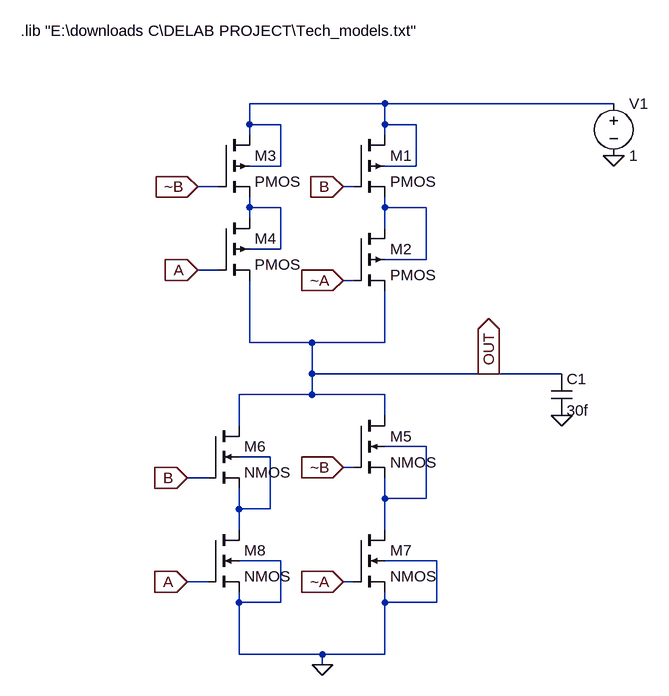
[diagram p0: schematic gate_xorr.asc]
gate_xorr.asc, the LTspice schematic file:
Version 4
SHEET 1 880 872
WIRE 272 -48 64 -48
WIRE 624 -48 272 -48
WIRE 64 -16 64 -48
WIRE 112 -16 64 -16
WIRE 272 -16 272 -48
WIRE 320 -16 272 -16
WIRE 64 0 64 -16
WIRE 272 0 272 -16
WIRE 112 48 112 -16
WIRE 112 48 64 48
WIRE 320 48 320 -16
WIRE 320 48 272 48
WIRE 16 80 -16 80
WIRE 224 80 208 80
WIRE 64 112 64 96
WIRE 112 112 64 112
WIRE 272 112 272 96
WIRE 336 112 272 112
WIRE 64 128 64 112
WIRE 272 144 272 112
WIRE 112 176 112 112
WIRE 112 176 64 176
WIRE 336 192 336 112
WIRE 336 192 272 192
WIRE 16 208 -16 208
WIRE 224 224 208 224
WIRE 64 320 64 224
WIRE 160 320 64 320
WIRE 272 320 272 240
WIRE 272 320 160 320
WIRE 160 368 160 320
WIRE 432 368 160 368
WIRE 544 368 432 368
WIRE 160 400 160 368
WIRE 160 400 48 400
WIRE 272 400 160 400
WIRE 272 432 272 400
WIRE 48 448 48 400
WIRE 336 480 272 480
WIRE 96 496 48 496
WIRE 224 512 208 512
WIRE 0 528 -32 528
WIRE 272 560 272 528
WIRE 336 560 336 480
WIRE 336 560 272 560
WIRE 48 576 48 544
WIRE 96 576 96 496
WIRE 96 576 48 576
WIRE 48 608 48 576
WIRE 272 608 272 560
WIRE 112 656 48 656
WIRE 352 656 272 656
WIRE 0 688 -32 688
WIRE 224 688 208 688
WIRE 48 720 48 704
WIRE 112 720 112 656
WIRE 112 720 48 720
WIRE 272 720 272 704
WIRE 352 720 352 656
WIRE 352 720 272 720
WIRE 48 800 48 720
WIRE 176 800 48 800
WIRE 272 800 272 720
WIRE 272 800 176 800
WIRE 176 816 176 800
FLAG 624 32 0
FLAG 544 432 0
FLAG 432 368 OUT
IOPIN 432 368 Out
FLAG -16 208 A
IOPIN -16 208 In
FLAG -32 688 A
IOPIN -32 688 In
FLAG 208 80 B
IOPIN 208 80 In
FLAG -32 528 B
IOPIN -32 528 In
FLAG -16 80 ~B
IOPIN -16 80 In
FLAG 208 512 ~B
IOPIN 208 512 In
FLAG 208 224 ~A
IOPIN 208 224 In
FLAG 208 688 ~A
IOPIN 208 688 In
FLAG 176 816 0
SYMBOL pmos4 224 0 R0
SYMATTR InstName M1
SYMATTR Value2 l=32n w=128n
SYMBOL pmos4 224 144 R0
SYMATTR InstName M2
SYMATTR Value2 l=32n w=128n
SYMBOL pmos4 16 0 R0
SYMATTR InstName M3
SYMATTR Value2 l=32n w=128n
SYMBOL pmos4 16 128 R0
SYMATTR InstName M4
SYMATTR Value2 l=32n w=128n
SYMBOL nmos4 224 432 R0
SYMATTR InstName M5
SYMATTR Value2 l=32n w=64n
SYMBOL nmos4 0 448 R0
SYMATTR InstName M6
SYMATTR Value2 l=32n w=64n
SYMBOL nmos4 224 608 R0
SYMATTR InstName M7
SYMATTR Value2 l=32n w=64n
SYMBOL nmos4 0 608 R0
SYMATTR InstName M8
SYMATTR Value2 l=32n w=64n
SYMBOL voltage 624 -64 R0
WINDOW 123 0 0 Left 0
WINDOW 39 0 0 Left 0
SYMATTR InstName V1
SYMATTR Value 1
SYMBOL cap 528 368 R0
SYMATTR InstName C1
SYMATTR Value 30f
TEXT -288 -160 Left 2 !.lib "E:\\downloads C\\DELAB PROJECT\\Tech_models.txt"

The netlist it stands for:
* gate_xorr.asc
M1 N001 B N003 N001 PMOS l=32n w=128n
M2 N003 ~A OUT N003 PMOS l=32n w=128n
M3 N001 ~B N002 N001 PMOS l=32n w=128n
M4 N002 A OUT N002 PMOS l=32n w=128n
M5 OUT ~B N004 N004 NMOS l=32n w=64n
M6 OUT B N005 N005 NMOS l=32n w=64n
M7 N004 ~A 0 0 NMOS l=32n w=64n
M8 N005 A 0 0 NMOS l=32n w=64n
V1 N001 0 1
C1 OUT 0 30f
.model NMOS NMOS
.model PMOS PMOS
.lib standard.mos
.lib "E:\downloads C\DELAB PROJECT\Tech_models.txt"
.backanno
.end